# EAGLE design iv-18 (EAGLE 9.6.2)
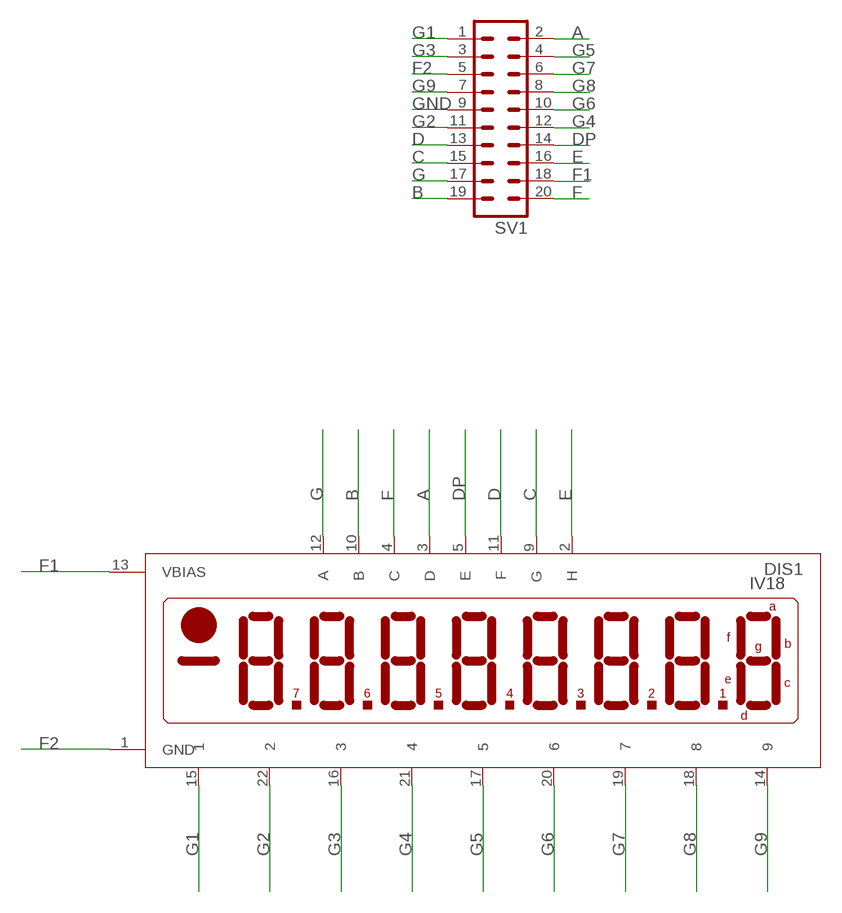
[diagram p0: schematic, sheet 1]

## Parts
DIS1  IV18  [IV18]
SV1  MA10-2  [MA10-2]

## Nets
A: DIS1.3(D) SV1.2
B: DIS1.10(B) SV1.19
C: DIS1.9(G) SV1.15
D: DIS1.11(F) SV1.13
DP: DIS1.5(E) SV1.14
E: DIS1.2(H) SV1.16
F: DIS1.4(C) SV1.20
F1: DIS1.13(VBIAS) SV1.18
F2: DIS1.1(GND) SV1.5
G: DIS1.12(A) SV1.17
G1: DIS1.15 SV1.1
G2: DIS1.22 SV1.11
G3: DIS1.16 SV1.3
G4: DIS1.21 SV1.12
G5: DIS1.17 SV1.4
G6: DIS1.20 SV1.10
G7: DIS1.19 SV1.6
G8: DIS1.18 SV1.8
G9: DIS1.14 SV1.7
GND: SV1.9

## Library data of the parts
DIS1 = adafruit:IV18: LCD DISPLAY 8-character 7 segment
SV1 = con-lstb:MA10-2: PIN HEADER; OC_FARNELL: unknown; OC_NEWARK: unknown

## Board
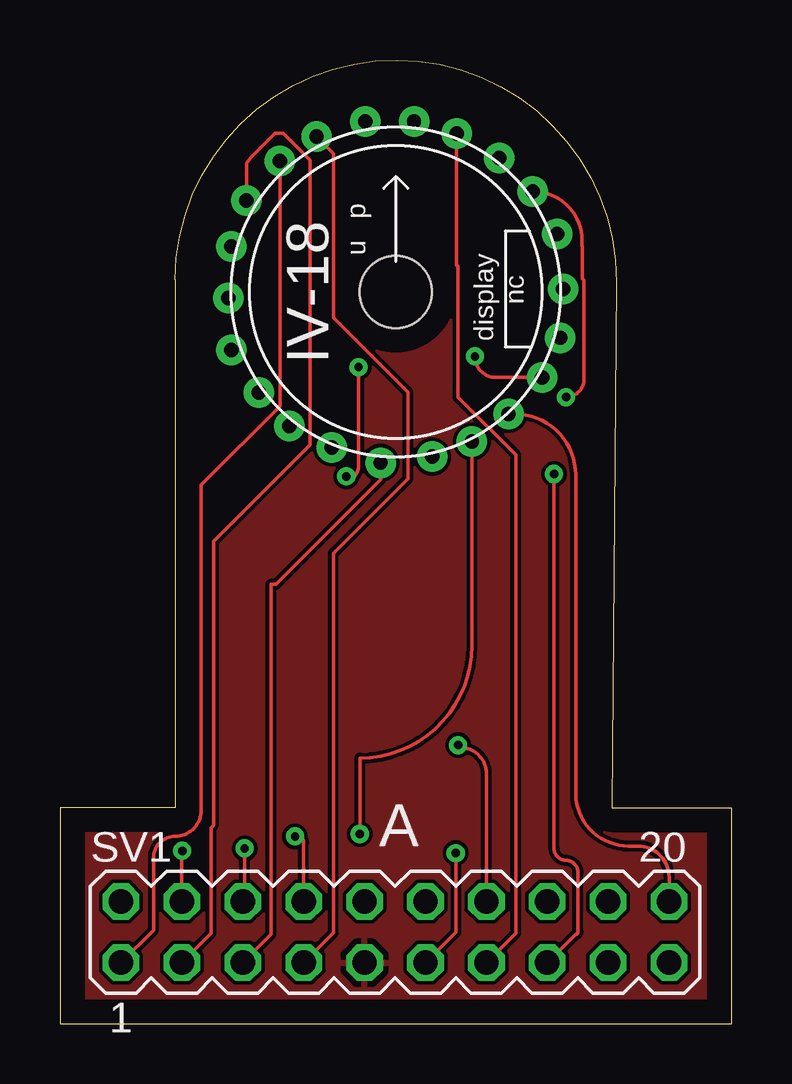
[diagram p1: board, top side]
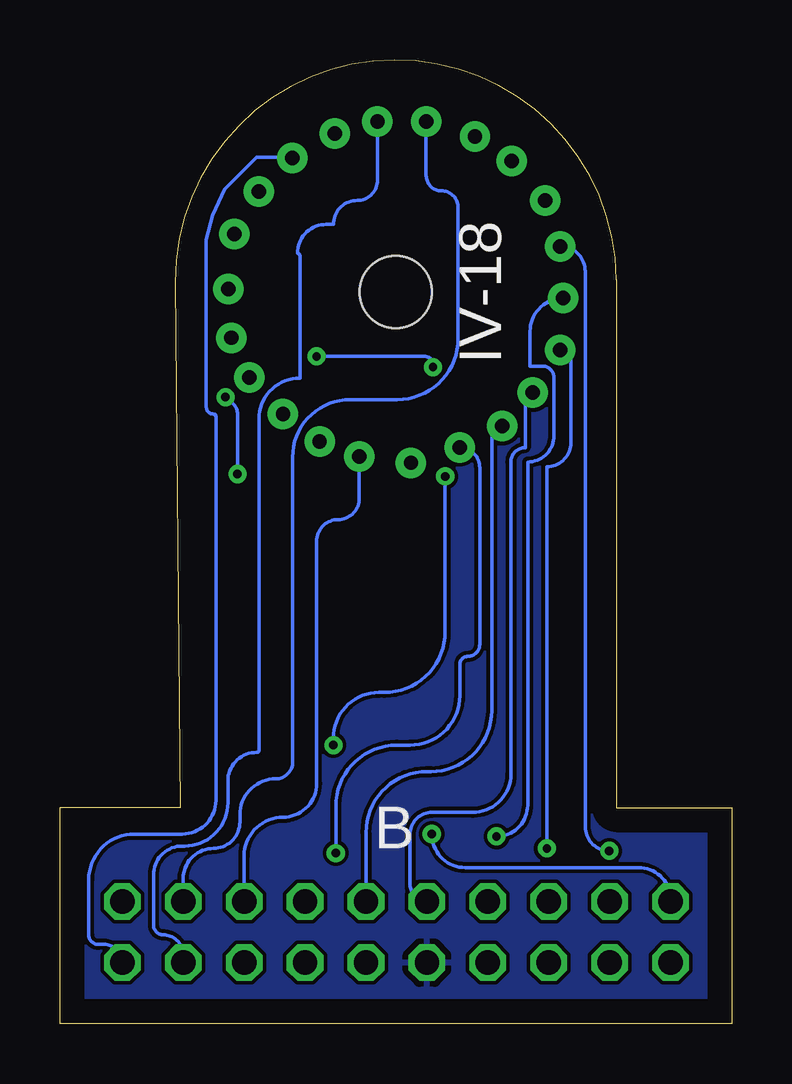
[diagram p2: board, bottom side, seen from below]

Size 28 x 40.15 mm. Coordinates in mm from the lower left corner, seen from the top.
Outline: 0,0 28,0 28,9 23,9 23.2,30.9 arc180 4.8,31 4.8,9 0,9 0,0
Copper layers (1*16): Top 0.035mm / dielectric 1.5mm / Bottom 0.035mm
Design rules "default": minimum track width 6mil, minimum drill 0.35mm, track to track 6mil, track to pad 6mil, pad to pad 6mil, via to via 6mil, smd to smd 6mil, copper to edge 40mil, drill to drill 6mil, minimum pad ring 10mil, minimum via ring 8mil, stop-mask expansion 4mil, vias tented up to drill 0mil, thermal gap 10mil
Holes 3 mm at 14,30.48

### Footprints (pad centres in the part's own frame; a part is rotated, then mirrored left to right if it is on the bottom)
IV18 = drill 0.6 pad 1.27: 1 -0.635,-7.112; 2 1.524,-6.858; 3 3.175,-6.223; 4 4.699,-5.08; 5 6.096,-3.556; 6 6.858,-1.905; 7 6.985,0.127; 8 6.731,2.413; 9 5.715,4.191; 10 4.318,5.588; 11 2.54,6.604; 12 0.762,7.112; 13 -1.27,7.112; 14 -3.302,6.477; 15 -4.826,5.461; 16 -6.223,3.81; 17 -6.858,1.905; 18 -6.985,-0.254; 19 -6.858,-2.413; 20 -5.715,-4.191; 21 -4.445,-5.588; 22 -2.667,-6.477
MA10-2 = drill 1.016 octagon: 1 -11.43,-1.27; 2 -11.43,1.27; 3 -8.89,-1.27; 4 -8.89,1.27; 5 -6.35,-1.27; 6 -6.35,1.27; 7 -3.81,-1.27; 8 -3.81,1.27; 9 -1.27,-1.27; 10 -1.27,1.27; 11 1.27,-1.27; 12 1.27,1.27; 13 3.81,-1.27; 14 3.81,1.27; 15 6.35,-1.27; 16 6.35,1.27; 17 8.89,-1.27; 18 8.89,1.27; 19 11.43,-1.27; 20 11.43,1.27

### Placement (x,y rotation side)
DIS1  14,30.48 0 top
SV1  13.97,3.81 0 top

### Tracks (layer width: path | path; a pad name or v marks a point on that pad's centre or on a via)
A  (via drill 0.35)
  Top 0.152: v12.5,7.9 12.5,11.06 arc90 17.18,15.74 DIS1.3
  Bottom 0.152: SV1.2 2.54,5.16 arc-90 3.88,6.5 11.1,6.5 arc90 v12.5,7.9
B
  Bottom 0.152: SV1.19 arc-90 26.16,3.3 26.4,3.3 arc90 26.8,3.7 26.8,6 arc90 24.9,7.9 22.9,7.9 arc-90 21.5,9.3 21.5,25.3 arc-90 21.6,25.4 arc90 21.9,25.7 21.9,32.67 21.63,33.68 21.14,34.76 19.8,36.1 18.35,36.1 DIS1.10
C  (via drill 0.35)
  Top 0.152: SV1.15 21.5,3.72 arc90 21.6,3.82 21.6,6.3 arc90 21.1,6.8 arc-90 20.6,7.3 v20.6,22.9 | 20,34.39 DIS1.9 arc-90 21.77,32.62 21.77,32.44 21.79,32.37 21.79,31.03 21.85,30.96 21.85,26.85 arc-90 v21.1,26.1
  Bottom 0.152: v20.6,22.9 20.6,25.4 arc-90 21.2,26 arc90 21.15,26.05 arc-90 v21.1,26.1
D
  Top 0.152: SV1.13 19,3.76 19,23.7 16.59,26.11 16.59,31.55 16.54,31.61 DIS1.11
DP  (via drill 0.35)
  Top 0.152: SV1.14 17.78,10.42 arc90 16.7,11.5 arc-90 v16.6,11.6 | DIS1.5 18.18,26.92 arc-90 v17.3,27.8 | v12.45,27.35 12.45,23.25 arc-90 11.8,22.6 11.8,22.66 arc-90 v11.94,22.8
  Bottom 0.152: v17.3,27.8 12.8,27.8 arc90 12.4,27.4 arc90 v12.45,27.35 | v11.94,22.8 11.94,16.34 arc90 14.48,13.8 14.7,13.8 arc-90 16.6,11.9 v16.6,11.6
E
  Bottom 0.152: SV1.16 20.32,6.98 arc90 18.7,8.6 arc-90 17.3,10 17.3,20.1 arc90 16.4,21 arc-90 15.52,21.88 DIS1.2
F
  Top 0.152: SV1.20 25.4,6.1 arc90 24.1,7.4 23.7,7.4 arc-90 21.5,9.6 21.5,22.86 arc90 18.96,25.4 DIS1.4
F1
  Bottom 0.152: SV1.18 22.86,6.04 arc90 21.6,7.3 arc-90 20.5,8.4 20.5,8.7 arc90 19,10.2 arc-90 18.3,10.9 18.3,23.6 arc90 15.9,26 13.94,26 arc-90 11.4,28.54 11.4,34 arc-90 12.1,34.7 arc90 12.73,35.33 DIS1.13
F2
  Top 0.152: SV1.5 8.8,3.72 8.8,18.3 | 8.8,18.3 | DIS1.1 13.37,22.66 9,18.3 8.8,18.3
G
  Bottom 0.152: SV1.17 22.86,2.86 arc-90 23.7,3.7 arc90 24.1,4.1 24.1,6.2 arc90 22.9,7.4 22.8,7.4 arc-90 21,9.2 21,10.1 arc90 19.8,11.3 arc-90 19.7,11.4 19.7,25.2 arc90 18,26.9 18,32 arc-90 18.1,32.1 arc90 16.9,33.3 16.6,33.3 arc90 15.6,34.3 arc-90 14.76,35.14 DIS1.12
G1
  Top 0.152: SV1.1 3.9,3.9 3.9,6.9 arc-90 4.8,7.8 arc90 5.89,8.89 5.89,22.45 9.17,25.73 DIS1.15
G2  (via drill 0.35)
  Top 0.152: SV1.11 16.5,3.8 v16.5,7.1
  Bottom 0.152: v16.5,7.1 16.5,9.06 arc90 13.96,11.6 13.4,11.6 arc-90 11.33,13.67 11.33,14.97 arc90 11,15.3 arc-90 10.5,15.8 10.5,23.17 arc-90 DIS1.22
G3
  Top 0.152: SV1.3 6.3,3.76 6.3,8.17 6.4,8.27 6.4,20.1 10.42,24.12 10.42,35.98 9.3,37.1 8.98,37.1 8.92,37.06 7.94,36.08 7.78,35.85 DIS1.16
G4
  Bottom 0.152: 9.9,24.55 arc90 DIS1.21 arc-90 10,24.45 10,13.04 arc90 12.54,10.5 12.7,10.5 arc-90 15.24,7.96 SV1.12
G5  (via drill 0.35)
  Top 0.152: SV1.4 5.08,7.18 arc-90 v5.1,7.2
  Bottom 0.152: v5.1,7.2 arc90 6.1,8.2 6.1,31.34 arc-90 DIS1.17
G6
  Bottom 0.152: DIS1.20 arc-90 8.6,25.97 8.6,24 arc-90 9.2,23.4 9.2,10.4 arc90 10.8,8.8 12.5,8.8 arc-90 13.4,7.9 13.4,5.78 arc-90 SV1.10
G7  (via drill 0.35)
  Top 0.152: SV1.6 arc90 7.7,5.16 v7.7,7.3
  Bottom 0.152: v7.7,7.3 7.7,23.2 arc-90 6.7,24.2 6.7,27.62 arc-90 DIS1.19
G8  (via drill 0.35)
  Top 0.152: SV1.8 10.16,7.54 arc90 9.9,7.8 v9.8,7.8
  Bottom 0.152: v9.8,7.8 arc-90 8.5,9.1 8.5,23.4 arc-90 7.4,24.5 7.4,26.9 arc-90 7.9,27.4 8.4,27.4 8.4,28.84 arc90 DIS1.18
G9
  Top 0.152: SV1.7 11.4,3.78 11.4,6 11.4,6.1 11.4,19.6 14.5,22.7 14.5,26.31 11.41,29.41 11.41,36.25 DIS1.14
GND
  pour Top: -3.4,-1.6 29.3,-1.6 29.5,-1.4 29.5,36.1 27.2,38.4 21.3,44.3 10.2,44.3 -3.4,30.7 -3.4,-1.5
  pour Bottom: 30.1,-2.7 30.8,-2 30.8,35.9 30.8,36.6 22.1,45.3 10,45.3 -4.2,31.1 -4.2,28.8 -4.2,-2.5 29.9,-2.5

### Text on the board
tPlace: IV-18 | A
bPlace: IV-18 | B